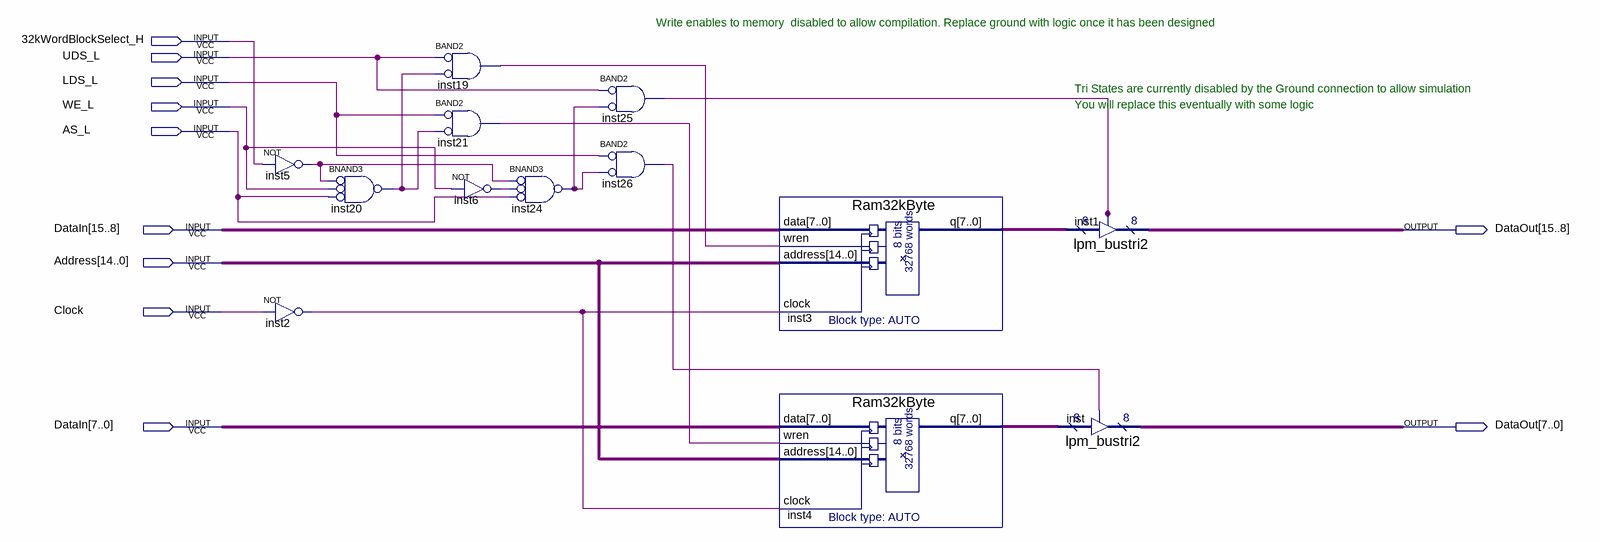
[diagram p0: schematic sheet]
// Quartus schematic SramBlock_32KWord.bdf as structural Verilog: 13 symbols, 11 pins
module SramBlock_32KWord (
  input  \32kWordBlockSelect_H ,
  input  UDS_L,
  input  LDS_L,
  input  WE_L,
  input  AS_L,
  input  [15:0] DataIn,
  input  [14:0] Address,
  input  Clock,
  output [15:0] DataOut
);

  wire inst2_out, inst5_out, inst6_out, inst19_out, inst20_out, inst21_out, inst24_out, inst25_out,
       inst26_out;
  wire [7:0] inst3_q, inst4_q;

  not inst5 (inst5_out, \32kWordBlockSelect_H );
  not inst2 (inst2_out, Clock);
  nand inst20 (inst20_out, ~inst5_out, ~WE_L, ~AS_L);  // BNAND3
  and inst19 (inst19_out, ~UDS_L, ~inst20_out);  // BAND2
  and inst21 (inst21_out, ~LDS_L, ~inst20_out);  // BAND2
  not inst6 (inst6_out, WE_L);
  nand inst24 (inst24_out, ~inst5_out, ~inst6_out, ~AS_L);  // BNAND3
  and inst25 (inst25_out, ~UDS_L, ~inst24_out);  // BAND2
  and inst26 (inst26_out, ~LDS_L, ~inst24_out);  // BAND2
  Ram32kByte inst3 (.data(DataIn[15:8]), .wren(inst19_out), .address(Address), .clock(inst2_out), .q(inst3_q));
  Ram32kByte inst4 (.data(DataIn[7:0]), .wren(inst21_out), .address(Address), .clock(inst2_out), .q(inst4_q));
  lpm_bustri2 inst1 (.enabledt(inst25_out), .data(inst3_q), .tridata(DataOut[15:8]));
  lpm_bustri2 inst (.enabledt(inst26_out), .data(inst4_q), .tridata(DataOut[7:0]));

  // Notes on the sheet:
  //   Write enables to memory  disabled to allow compilation. Replace ground with logic once it has been designed
  //   Tri States are currently disabled by the Ground connection to allow simulation
  //   You will replace this eventually with some logic
endmodule
